# Altium schematic sheet InterlockControl.SchDoc
size 297 x 209 mm; SheetNumber: 3; SheetTotal: 4; swcgroup: FabLabs; Org: Sainsbury Wellcome Centre; Add1: 25 Howland Street; Add2: London; Add3: W1T 4JG; WebAddress: www.sainsburywellcome.org; SheetSize: A4; SheetName: Interlock Power Control
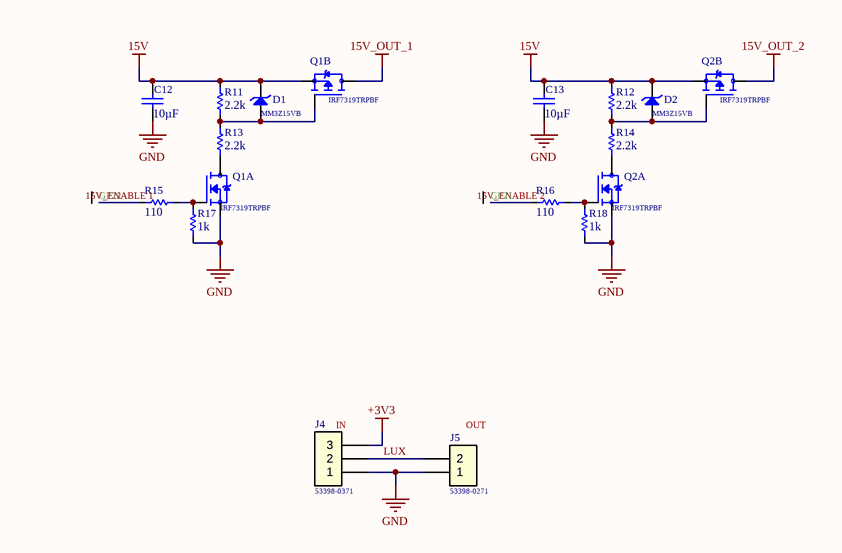
[diagram p0: InterlockControl.SchDoc]

## Parts
C12  value 10µF  [CAPC3225X279X50NL20T25]  (hidden comment: C1210-10uF-50V-10%-X7R)
C13  value 10µF  [CAPC3225X279X50NL20T25]  (hidden comment: C1210-10uF-50V-10%-X7R)
D1  MM3Z15VB  [SODFL250X100-2N]
D2  MM3Z15VB  [SODFL250X100-2N]
J4  53398-0371  [MOLX-53398-0371_V]
J5  53398-0271  [MOLX-53398-0271_V]
Q1  IRF7319TRPBF  [SOIC127P600X175-8N]  (parts A,B of 2)
Q2  IRF7319TRPBF  [SOIC127P600X175-8N]  (parts A,B of 2)
R11  value 2.2k  [FP-CPF0603-IPC_B]  (hidden comment: R0603-2k2-1/16W-0.1%)
R12  value 2.2k  [FP-CPF0603-IPC_B]  (hidden comment: R0603-2k2-1/16W-0.1%)
R13  value 2.2k  [FP-CPF0603-IPC_B]  (hidden comment: R0603-2k2-1/16W-0.1%)
R14  value 2.2k  [FP-CPF0603-IPC_B]  (hidden comment: R0603-2k2-1/16W-0.1%)
R15  value 110  [FP-CPF0603-IPC_B]  (hidden comment: R0603-110R-1/16W-0.1%)
R16  value 110  [FP-CPF0603-IPC_B]  (hidden comment: R0603-110R-1/16W-0.1%)
R17  value 1k  [FP-CPF0603-IPC_B]  (hidden comment: R0603-1k-1/16W-0.1%)
R18  value 1k  [FP-CPF0603-IPC_B]  (hidden comment: R0603-1k-1/16W-0.1%)

## Nets
15V: C12.2 C13.2 D1.2(C) D2.2(C) Q1.3(S) Q2.3(S) R11.2 R12.2
15V_OUT_1: Q1.5(D)
15V_OUT_2: Q2.5(D)
+3V3: J4.3
GND: C12.1 C13.1 J4.1 J5.1 Q1.1(S) Q2.1(S) R17.1 R18.1
GP21: R16.1
GP22: R15.1
LUX: J4.2 J5.2
NetD1_1: D1.1(A) Q1.4(G) R11.1 R13.2
NetD2_1: D2.1(A) Q2.4(G) R12.1 R14.2
NetQ1_2: Q1.2(G) R15.2 R17.2
NetQ1_7: Q1.7(D) R13.1
NetQ2_2: Q2.2(G) R16.2 R18.2
NetQ2_7: Q2.7(D) R14.1

## Notes on the sheet
- 15V_ENABLE 1
- 15V_ENABLE 2
- (near J4) IN
- (near J5) OUT
- FILE
- VARIANT
- DATE
- REVISION
- SHEET
- /
- PROJECT
- SIZE

## Library data of the parts
C12 C13 = CMP-611-0024-5: 10uF ±10% 50V Ceramic Capacitor X7R 1210 (3225 Metric); Pick&PlaceFootprint: C1210; Voltage Rating: 50V; Case/Package: 1210; Capacitor Type: Ceramic; Mount: Surface Mount; Tolerance: 10%; Dielectric: X7R; Capacitance: 10uF; RoHS: Yes
D1 D2 = CMP-822-0003-4: Zener Diode, 15V V(Z), 2%, 0.2W, Silicon, Unidirectional; PartNumber: MM3Z5V1B; Pick&PlaceFootprint: SOD323; Mount: Surface Mount
J4 = CMP-370-0033-4: Board Connector, 3 Contact(s), 1 Row(s), Male, Straight, 0.049 inch Pitch, Surface Mount Terminal, Locking, Natural Insulator, Receptacle; PCB Contact Pattern: RECTANGULAR; Mixed Contacts: No; Dielectric Withstanding Voltage (AC): 250V; Insulation Resistance: 100MR; Body Breadth: 0.146inch; Number Of PCB Rows: 1; Contact Style: Blade Pin; Durability: 30Cycles; Number of Contacts: 3; Contact Resistance: 20mR; Rated Current (Signal): 1A; Reference Standard: UL; Body Depth: 0.185inch; Board Mounting Option: SOLDER HOLDING POSTS; Body Length: 0.335inch; Plating Thickness: 39uin; Polarization Key: POLARIZED HOUSING; Mating Information: MULTIPLE MATING PARTS AVAILABLE; Option: General Purpose; Reliability: COMMERCIAL; Insulation Color: Natural; Contact Material: Bronze; Flammability Rating: UL94 V-0; DIN Conformance: No; IEC Conformance: No; PartNumber: 53398-0371; Min Operating Temperature: -40°C; REACH SVHC: Yes; Insulation Material: Nylon; Connector Type: BOARD CONNECTOR; Body/Shell Style: RECEPTACLE; Terminal Pitch: 1.25mm; Mounting Style: STRAIGHT; Contact Finish - Termination: Tin (Sn); Number of Rows Loaded: 1; Termination: SMD/SMT; Contact Gender: Male; Filter Feature: No; MIL Conformance: No; Mount: Board; Contact Finish - Mating: TIN (39) OVER NICKEL; Number Of Connectors: 1; RoHS Compliant: Yes; JESD-609 Code: e3; Max Operating Temperature: 85°C; Mating Contact Pitch: 0.049inch; Contact Pattern: RECTANGULAR; Mounting Option 1: LOCKING
J5 = CMP-370-0034-4: Board Connector, 2 Contact(s), 1 Row(s), Male, Straight, 0.049 inch Pitch, Surface Mount Terminal, Locking, Natural Insulator, Receptacle; Board Mounting Option: FITTING NAIL; Option: General Purpose; Contact Resistance: 20mR; Number Of Connectors: 1; DIN Conformance: No; Contact Pattern: RECTANGULAR; Reference Standard: UL; Insulation Resistance: 100MR; Rated Current (Signal): 1A; Mating Information: MULTIPLE MATING PARTS AVAILABLE; Polarization Key: POLARIZED HOUSING; Durability: 30Cycles; Body Length: 0.285inch; Contact Style: Blade Pin; Plating Thickness: 39uin; Number of Contacts: 2; Dielectric Withstanding Voltage (AC): 250V; Body Depth: 0.185inch; Body Breadth: 0.165inch; Reliability: COMMERCIAL; Insulation Color: Natural; REACH SVHC: Yes; JESD-609 Code: e3; Mount: Board; Mounting Option 1: LOCKING; Flammability Rating: UL94 V-0; Contact Finish - Mating: MATTE TIN (39) OVER NICKEL; Contact Material: Bronze; Mixed Contacts: No; Min Operating Temperature: -40°C; Number of Rows Loaded: 1; Number Of PCB Rows: 1; Connector Type: BOARD CONNECTOR; IEC Conformance: No; RoHS Compliant: Yes; Filter Feature: No; Insulation Material: Polyamide; MIL Conformance: No; Termination: SMD/SMT; Max Operating Temperature: 85°C; PartNumber: 53398-0271; Mating Contact Pitch: 0.049inch; PCB Contact Pattern: RECTANGULAR; Mounting Style: STRAIGHT; Body/Shell Style: RECEPTACLE; Contact Finish - Termination: Tin (Sn); Terminal Pitch: 1.25mm; Contact Gender: Male
Q1 Q2 = CMP-830-0006-2: Power Field-Effect Transistor, 6.5A I(D), 30V, 0.029ohm, 2-Element, N-Channel and P-Channel, Silicon, Metal-oxide Semiconductor FET, MS-012AA; pin to pad: 5>5+6 7>7+8; Pick&PlaceFootprint: SOIC-8; PartNumber: IRF7319TRPBF; Mount: Surface Mount
R11-R14 = CMP-633-0070-10: Surface Mount Resistor 2.2k Ohm 1/16 W 0.1% 0603 (1608 Metric); Number of Resistors: 1; Voltage Rating (DC): 50V; Temperature Coefficient: 25ppm/°C; Pick&PlaceFootprint: R0603; Power Rating: 62.5mW; Max Power Dissipation: 62.5 mW; Width: 0.8mm; Tolerance: 0.1%; RoHS: Yes; Resistance Tolerance: 0.1%; Case/Package: 0603; Case Code (Imperial): 0603; Series: CPF; Case Code (Metric): 1608; Number of Pins: 2; Length: 1.6mm; Resistance: 2.2k; Mount: Surface Mount; Voltage Rating: 50V; REACH SVHC: No SVHC; RoHS Compliant: Yes; Termination: Solder; ELV: Compliant; Height: 0.45mm; Weight: 7.1E-05oz; Composition: Thin Film; Max Operating Temperature: 155°C; Min Operating Temperature: -55°C; Technology: Thin Film; Packaging: Tape and Reel; Resistor Type: Thin Film; Size Code: 0603; Number of Terminations: 2
R15 R16 = CMP-633-0080-2: Surface Mount Resistor 110 Ohm 1/16 W 0.1% 0603 (1608 Metric); Max Power Dissipation: 62.5 mW; Temperature Coefficient: 25ppm/°C; Voltage Rating: 50V; Power Rating: 62.5mW; Pick&PlaceFootprint: R0603; Number of Resistors: 1; Composition: Thin Film; Series: CPF; Technology: THIN FILM; Resistance: 110; Resistance Tolerance: 0.1%; Termination: Wraparound; Case/Package: 0603; Max Operating Temperature: 155°C; Case Code (Imperial): 0603; ELV: Compliant; REACH SVHC: Yes; Height: 0.45mm; Voltage Rating (DC): 50V; Resistor Type: FIXED RESISTOR; RoHS: Yes; RoHS Compliant: Yes; Number of Terminations: 2; Tolerance: 0.1%; Case Code (Metric): 1608; Mount: Surface Mount; Min Operating Temperature: -55°C; Length: 1.6mm; Construction: Chip; Size Code: 0603; Packaging: Tape and Reel; Weight: 7.1E-05oz; Number of Pins: 2; Width: 0.8mm
R17 R18 = CMP-633-0013-15: Surface Mount Resistor 1k Ohm 1/16 W 0.1% 0603 (1608 Metric); Max Power Dissipation: 62.5 mW; Voltage Rating (DC): 50V; Number of Resistors: 1; Power Rating: 62.5mW; Pick&PlaceFootprint: R0603; Temperature Coefficient: 25ppm/°C; Case Code (Imperial): 0603; RoHS Compliant: Yes; Length: 1.6mm; Resistance Tolerance: 0.1%; Technology: Thin Film; REACH SVHC: No SVHC; Termination: Solder; Tolerance: 0.1%; Resistance: 1k; Size Code: 0603; Height: 0.45mm; Case/Package: 0603; Number of Pins: 2; Max Operating Temperature: 155°C; Series: CPF; RoHS: Yes; Weight: 7.1E-05oz; Width: 0.8mm; Case Code (Metric): 1608; Min Operating Temperature: -55°C; ELV: Compliant; Resistor Type: Thin Film; Number of Terminations: 2; Packaging: Tape and Reel; Composition: Thin Film; Voltage Rating: 50V; Mount: Surface Mount